# EAGLE design 03_cizgi_sensoru (EAGLE 9.6.2)
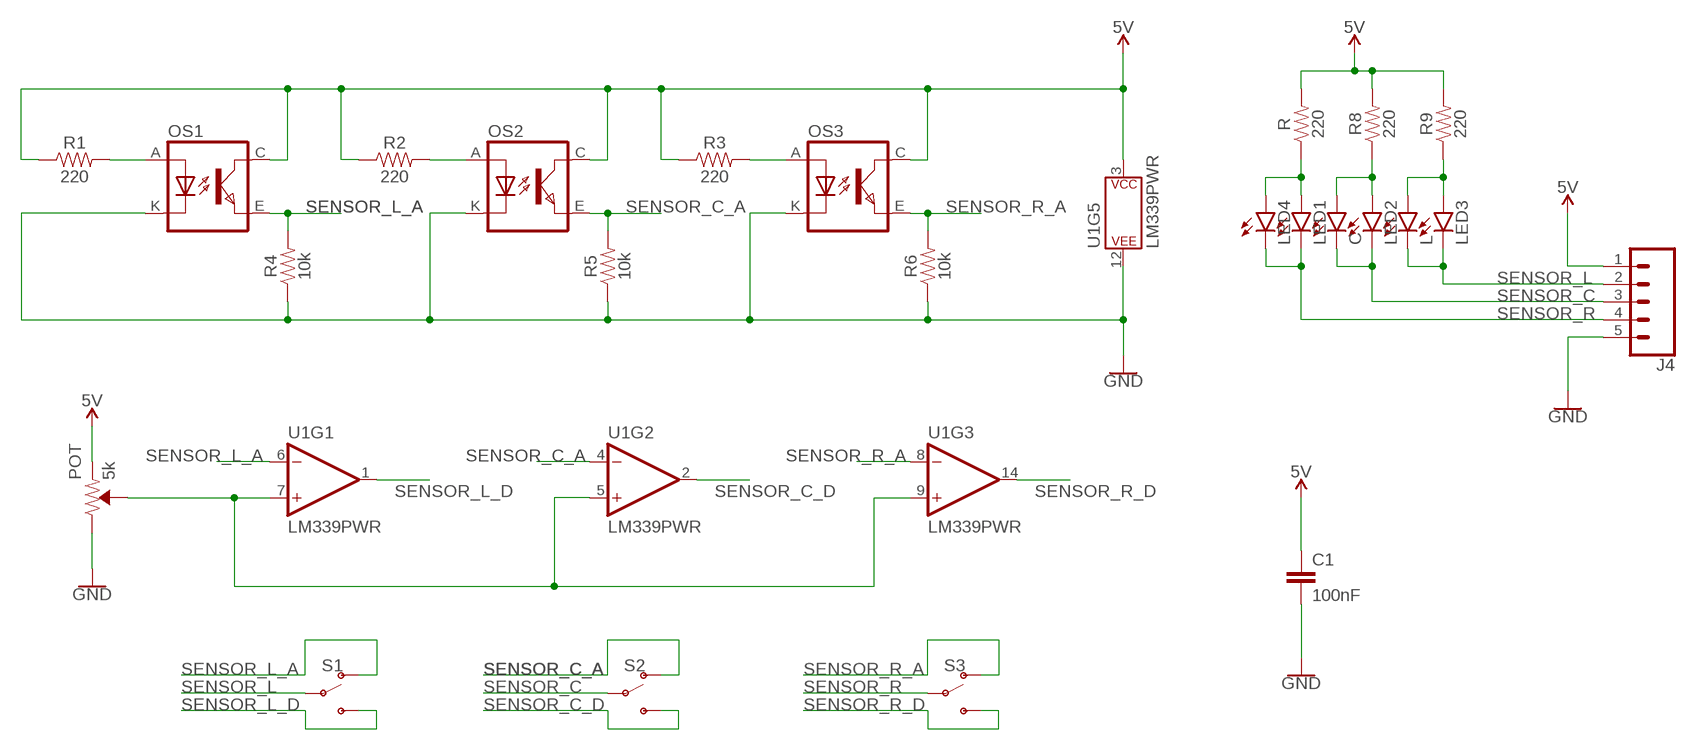
[diagram p0: schematic, sheet 1]

## Parts
C  LEDSML0805  [SML0805]
C1  100nF  0.33UF/330NF-0805-50V-10%  [0805]
J4  CONN_05  [1X05]
L  LEDSML0805  [SML0805]
LED1  LEDSML0805  [SML0805]
LED2  LEDSML0805  [SML0805]
LED3  LEDSML0805  [SML0805]
LED4  LEDSML0805  [SML0805]
OS1  TCRT5000  [TCRT5000]
OS2  TCRT5000  [TCRT5000]
OS3  TCRT5000  [TCRT5000]
POT  5k  TRIMPOT-SMD-5MM-CLOSED-1/4W-20%  [TRIMPOT-SMD-5MM]
R  220  0.22OHM-0805-1/4W-1%  [0805]
R1  220  0.22OHM-0805-1/4W-1%  [0805]
R2  220  0.22OHM-0805-1/4W-1%  [0805]
R3  220  0.22OHM-0805-1/4W-1%  [0805]
R4  10k  0.22OHM-0805-1/4W-1%  [0805]
R5  10k  0.22OHM-0805-1/4W-1%  [0805]
R6  10k  0.22OHM-0805-1/4W-1%  [0805]
R8  220  0.22OHM-0805-1/4W-1%  [0805]
R9  220  0.22OHM-0805-1/4W-1%  [0805]
S1  SWITCH-SPDT-SMD-RIGHT-ANGLE  [SWITCH_SPST_SMD_A]
S2  SWITCH-SPDT-SMD-RIGHT-ANGLE  [SWITCH_SPST_SMD_A]
S3  SWITCH-SPDT-SMD-RIGHT-ANGLE  [SWITCH_SPST_SMD_A]
U1  LM339PWR  LM339  [TSSOP-14]

## Nets
5V: C1.1 J4.1 OS1.C(COLLECTOR) OS2.C(COLLECTOR) OS3.C(COLLECTOR) POT.A(CCW) R1.1 R2.1 R3.1 R8.2 R9.2 R.2 U1.3(P$V+)
GND: C1.2 J4.5 OS1.K(CATHODE) OS2.K(CATHODE) OS3.K(CATHODE) POT.C(CW) R4.1 R5.1 R6.1 U1.12(P$V-)
N$1: OS1.A(ANODE) R1.2
N$2: OS2.A(ANODE) R2.2
N$3: OS3.A(ANODE) R3.2
N$4: POT.B(WIPER) U1.5(+IN) U1.7(+IN) U1.9(+IN)
N$5: LED1.A LED4.A R.1
N$6: C.A LED2.A R8.1
N$7: L.A LED3.A R9.1
SENSOR_C: C.C J4.3 LED2.C S2.2(P)
SENSOR_C_A: OS2.E(EMITTER) R5.2 S2.1(O) U1.4(-IN)
SENSOR_C_D: S2.3(S) U1.2(OUT)
SENSOR_L: J4.2 L.C LED3.C S1.2(P)
SENSOR_L_A: OS1.E(EMITTER) R4.2 S1.1(O) U1.6(-IN)
SENSOR_L_D: S1.3(S) U1.1(OUT)
SENSOR_R: J4.4 LED1.C LED4.C S3.2(P)
SENSOR_R_A: OS3.E(EMITTER) R6.2 S3.1(O) U1.8(-IN)
SENSOR_R_D: S3.3(S) U1.14(OUT)
Unconnected: U1.10(-IN) U1.11(+IN) U1.13(OUT)

## Library data of the parts
C L LED1-LED4 = led:LED: LED OSRAM: - CHIPLED LG R971, LG N971, LY N971, LG Q971, LY Q971, LO R971, LY R971 LH N974, LH R974 LS Q976, LO Q976, LY Q976 LO Q996 - Hyper CHIPLED LW Q18S LB Q993, LB Q99A, LB R99A - SideLED LS A670, LO A670, LY A670, LG A670, LP A670 LB A673, LV A673, LT A673, LW A673 LH A674 LY A675 LS A676, LA A676, LO A676, LY A676, LW A676 LS A679, LY A679, LG A679 - Hyper Micro SIDELED® LS Y876, LA Y876, LO Y876, LY Y876 LT Y87S - SmartLED LW L88C, LW L88S LB L89C, LB L89S, LG L890 LS L89K, LO L89K, LY L89K LS L896, LA L896, LO L896, LY L896 - TOPLED LS T670, LO T670, LY T670, LG T670, LP T670 LSG T670, LSP T670, LSY T670, LOP T670, LYG T670 LG T671, LOG T671, LSG T671 LB T673, LV T673, LT T673, LW T673 LH T674 LS T676, LA T676, LO T676, LY T676, LB T676, LH T676, LSB T676, LW T676 LB T67C, LV T67C, LT T67C, LS T67K, LO T67K, LY T67K, LW E67C LS E67B, LA E67B, LO E67B, LY E67B, LB E67C, LV E67C, LT E67C LW T67C LS T679, LY T679, LG T679 LS T770, LO T770, LY T770, LG T770, LP T770 LB T773, LV T773, LT T773, LW T773 LH T774 LS E675, LA E675, LY E675, LS T675 LS T776, LA T776, LO T776, LY T776, LB T776 LHGB T686 LT T68C, LB T68C - Hyper Mini TOPLED® LB M676 - Mini TOPLED Santana® LG M470 LS M47K, LO M47K, LY M47K Source: http://www.osram.convergy.de LUXEON: - LUMILED® LXK2-PW12-R00, LXK2-PW12-S00, LXK2-PW14-U00, LXK2-PW14-V00 LXK2-PM12-R00, LXK2-PM12-S00, LXK2-PM14-U00 LXK2-PE12-Q00, LXK2-PE12-R00, LXK2-PE12-S00, LXK2-PE14-T00, LXK2-PE14-U00 LXK2-PB12-K00, LXK2-PB12-L00, LXK2-PB12-M00, LXK2-PB14-N00, LXK2-PB14-P00, LXK2-PB14-Q00 LXK2-PR12-L00, LXK2-PR12-M00, LXK2-PR14-Q00, LXK2-PR14-R00 LXK2-PD12-Q00, LXK2-PD12-R00, LXK2-PD12-S00 LXK2-PH12-R00, LXK2-PH12-S00 LXK2-PL12-P00, LXK2-PL12-Q00, LXK2-PL12-R00 Source: www.luxeon.com KINGBRIGHT: KA-3528ASYC Source: www.kingbright.com
C1 = SparkFun-Capacitors:0.33UF/330NF: 0.33µF/330nF ceramic capacitors A capacitor is a passive two-terminal electrical component used to store electrical energy temporarily in an electric field.; PROD_ID: CAP-08469; VALUE: 0.33µF
J4 = SparkFun-Connectors:CONN_05: Multi connection point. Often used as Generic Header-pin footprint for 0.1 inch spaced/style header connections On any of the 0.1 inch spaced packages, you can populate with these: Break Away Headers - Straight <https://www.sparkfun.com/products/116> (PRT-00116) Break Away Male Headers - Right Angle <https://www.sparkfun.com/products/553> (PRT-00553) Female Headers <https://www.sparkfun.com/products/115> (PRT-00115) Break Away Headers - Machine Pin <https://www.sparkfun.com/products/117> (PRT-00117) Break Away Female Headers - Swiss Machine Pin <https://www.sparkfun.com/products/743> (PRT-00743) For SCREWTERMINALS and SPRING TERMINALS visit here: Screw Terimnals on SparkFun.com <https://www.sparkfun.com/search/results?term=Screw+Terminals> (5mm/3.5mm/2.54mm spacing) This device is also useful as a general connection point to wire up your design to another part of your project. Our various solder wires solder well into these plated through hole pads. Hook-Up Wire - Assortment (Stranded, 22 AWG) <https://www.sparkfun.com/products/11375> (PRT-11375) Hook-Up Wire - Assortment (Solid Core, 22 AWG) <https://www.sparkfun.com/products/11367> (PRT-11367) View the entire wire category on our website here <https://www.sparkfun.com/categories/141> Special notes: Molex polarized connector foot print use with SKU : PRT-08231 with associated crimp pins and housings. 1MM SMD Version SKU: PRT-10208
OS1-OS3 = tcrt5000:TCRT5000
POT = SparkFun-Resistors:TRIMPOT: Trimming Potentiometer (Trimpot) Three-terminal potentiometers, with an adjustable wiper and two adjustable resistors. A pot can be used to create a configurable voltage divider, or as a variable resistor. "Trimpots" are a subset of potentiometers, usually intended for "set-and-forget" applications. They're often more delicate than standard potentiometers - rated for fewer turns. Variants PTH-KNOB - PTH Trimpot w/ finger-adjustable knob Trimpot 10K with Knob <https://www.sparkfun.com/products/9806> (COM-09806) Datasheet <http://www.sparkfun.com/datasheets/Components/General/TSR-3386.pdf> SMD-3MM-CLOSED-FRAME - SMD 3mm Square Closed-Frame Trimpot Used on e.g. EasyDriver - Stepper Motor Driver <https://www.sparkfun.com/products/12779> Datasheet <http://www.bitechnologies.com/pdfs/22.pdf> (22AR10KTR) SMD-5MM - SMD 5mm Square Closed-Frame Trimpot Used on e.g. IOIO-OTG - V2.2 <https://www.sparkfun.com/products/13613> Datasheet <http://www.vishay.com/docs/51008/ts53.pdf> (TS53YL502MR10) SMD-3MM-1/10W-25% - 3mm Square Open-Frame Trimpot Used on e.g. SparkFun Shapeoko <https://www.sparkfun.com/products/13899> Datasheet <http://www.bourns.com/docs/Product-Datasheets/TC33.pdf> (TC33X-2-103E); PROD_ID: RES-11156
R R1-R6 R8 R9 = SparkFun-Resistors:0.22OHM: 0.22Ω resistor A resistor is a passive two-terminal electrical component that implements electrical resistance as a circuit element. Resistors act to reduce current flow, and, at the same time, act to lower voltage levels within circuits. - Wikipedia; PROD_ID: RES-09883; VALUE: 0.22
S1-S3 = SparkFun-Switches:SWITCH-SPDT: Single Pole, Double Throw (SPDT) Switch Single-pole, double-throw (SPDT) switch. Variant Overview SMD-AYZ0202 Surface Mount DPDT Switch <https://www.sparkfun.com/products/597> (COM-00597) Used on e.g. LilyPad Arduino USB - ATmega32U4 Board <https://www.sparkfun.com/products/12049> PTH-11.6X4.0MM SPDT Mini Power Switch <https://www.sparkfun.com/products/102> (COM-00102) Used on e.g. SparkFun Simon Says - Through-Hole Soldering Kit <https://www.sparkfun.com/products/10547> (KIT-10547) PTH-11.6X4.0MM-KIT KIT version of SPDT Mini Power Switch - Simplifies soldering by removing tStop of switch pins - only one side can be soldered. PTH-11.6X4.0MM-LOCK LOCK version of SPDT Mini Power Switch - Offset pins hold switch in place for easier soldering. SMD-RIGHT-ANGLE Surface Mount Right Angle Switch <https://www.sparkfun.com/products/10860> (COM-10860) Used on e.g. SparkFun ESP8266 Thing <https://www.sparkfun.com/products/13231>; PROD_ID: SWCH-10651; SF_SKU: COM-10860
U1 = SparkFun-IC-Amplifiers:LM339: Quad Comparator - LM339PWR Based on information from the SLCS006N datasheet from TI (www.ti.com). Created by nick@scantool.net, 2008. Updated 2016. SparkFun Products SparkFun OBD-II UART <https://www.sparkfun.com/products/9555> (WIG-09555) SparkFun Car Diagnostics Kit <https://www.sparkfun.com/products/10769> (RTL-10769); PROD_ID: IC-09990

## Board
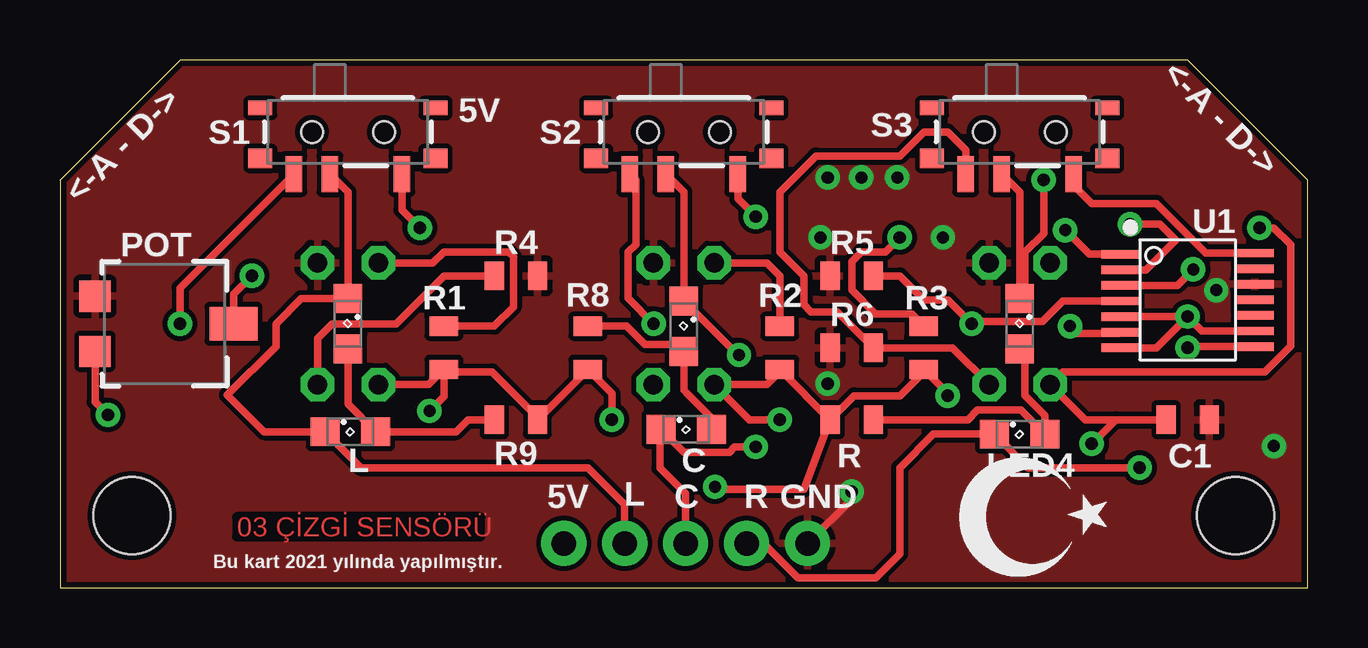
[diagram p1: board, top side]
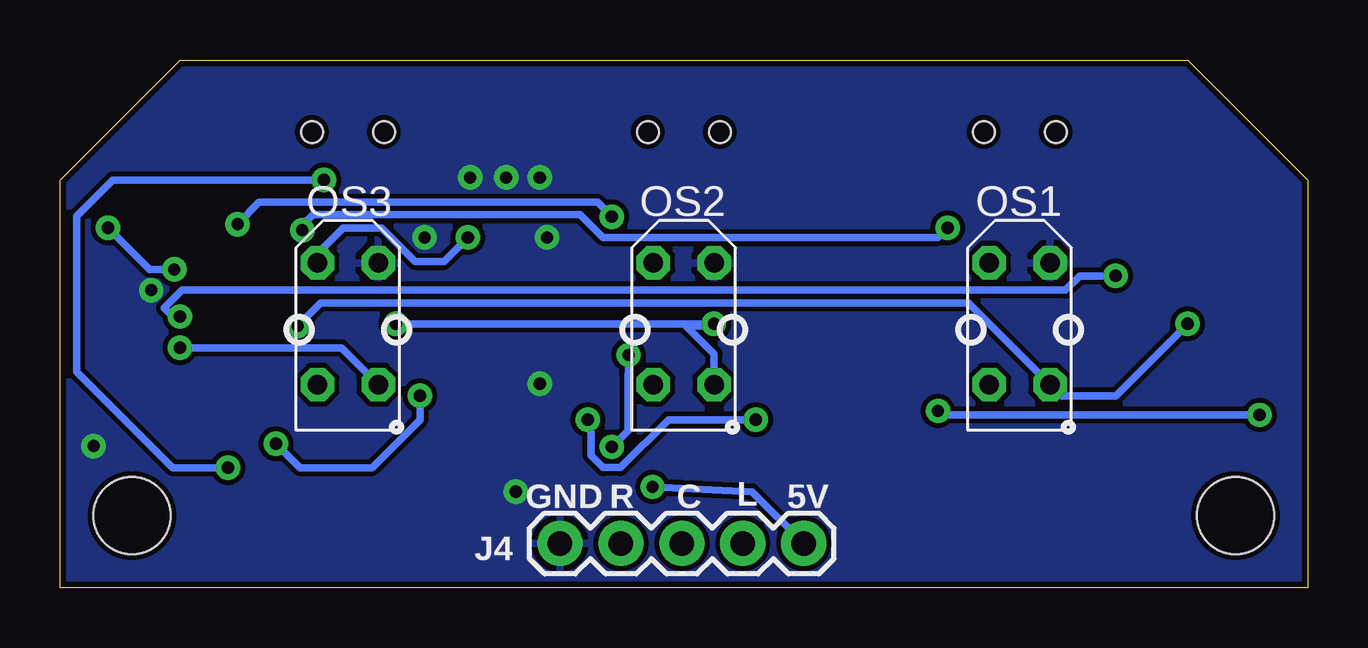
[diagram p2: board, bottom side, seen from below]

Size 52 x 22 mm. Coordinates in mm from the lower left corner, seen from the top.
Outline: 0,0 52,0 52,17 47,22 5,22 0,17 0,0
Copper layers (1*16): Top 0.035mm / dielectric 1.5mm / Bottom 0.035mm
Design rules "SparkFun": minimum track width 8mil, minimum drill 20mil, track to track 8mil, track to pad 8mil, pad to pad 8mil, via to via 8mil, smd to smd 8mil, copper to edge 10mil, drill to drill 8mil, minimum pad ring 12mil, minimum via ring 10mil, stop-mask expansion 4mil, vias tented up to drill 25mil, thermal gap 10mil
Holes 3.2 mm at 3,3 49,3

### Footprints (pad centres in the part's own frame; a part is rotated, then mirrored left to right if it is on the bottom)
SML0805 = smd 1.2 x 1.2: A 1.05,0; C -1.05,0
0805 = smd 0.8 x 1.2: 1 -0.9,0; 2 0.9,0
1X05 = drill 1.016 pad 1.88: 1 0,0; 2 2.54,0; 3 5.08,0; 4 7.62,0; 5 10.16,0
TCRT5000 = drill 0.8 octagon: A -2.54,-1.27; C 2.54,-1.27; E 2.54,1.27; K -2.54,1.27
TRIMPOT-SMD-5MM = smd 1.3 x 1.3: A 1.15,-2.54; C -1.15,-2.54 | smd 1.402 x 2: B 0,3.239
SWITCH_SPST_SMD_A = smd 0.7 x 1.5: 1 -2.25,-1.75; 2 -0.75,-1.75; 3 2.25,-1.75 | smd 1 x 0.6: GND1 -3.65,1; GND3 3.65,1 | smd 1 x 0.8: GND2 -3.65,-1.1; GND4 3.65,-1.1 | hole 0.9: -1.5,0; 1.5,0
TSSOP-14 = smd 1.6 x 0.35: 1 -2.8,1.9; 2 -2.8,1.25; 3 -2.8,0.6; 4 -2.8,-0.05; 5 -2.8,-0.7; 6 -2.8,-1.35; 7 -2.8,-2; 8 2.8,-1.95; 9 2.8,-1.3; 10 2.8,-0.65; 11 2.8,0; 12 2.8,0.65; 13 2.8,1.3; 14 2.8,1.95

### Placement (x,y rotation side)
C  26.1,6.6 0 top
C1  47,7 0 top
J4  21,1.84 180 bottom
L  12.1,6.5 0 top
LED1  40,11 270 top
LED2  26,10.9 270 top
LED3  12,11 270 top
LED4  40,6.4 0 top
OS1  12,11 270 bottom
OS2  26,11 270 bottom
OS3  40,11 270 bottom
POT  4,11 270 top
R  33,7 180 top
R1  16,10 90 top
R2  30,10 90 top
R3  36,10 90 top
R4  19,13 180 top
R5  33,13 0 top
R6  33,10 0 top
R8  22,10 270 top
R9  19,7 0 top
S1  12,19 0 top
S2  26,19 0 top
S3  40,19 0 top
U1  47,12 0 top
U$5  [TR_MINI]  36.3,-0.1 0 top

### Tracks (layer width: path | path; a pad name or v marks a point on that pad's centre or on a via)
5V  (via drill 0.51)
  Top 0.305: R1.1 16.1,9 18,9 19.9,7.1 R9.2 R8.2 23,8.1 v23,7 | OS1.C 15.36,8.46 R1.1 | POT.A 1.46,7.74 v2,7.2 | v15.4,7.36 16,7.96 R1.1 | R.2 31,4.1 27.2,4.1 v27.3,4.2 | R2.1 30.05,9.05 | 30.05,9.05 R.2 | R.2 33.1,8 35,8 36,9 R3.1 37,8.1 v37,8 | 44,7 42.73,7 OS3.C 41.81,9 50.23,9 51.3,10.07 51.3,14.3 50.6,15 v50,15 | 44,7 C1.1 | v47.23,13.26 46.57,12.6 U1.3 | 30.05,9.05 29.46,8.46 OS2.C 28.73,7 v30,7 | v43,6 44,7
  Bottom 0.305: v2,7.2 15.24,7.2 v15.4,7.36 | v50,15 48.26,13.26 v47.23,13.26 | v23,7 26.64,7 28.64,5 29.36,5 29.86,5.51 29.86,6.86 v30,7 | v37,8 37,7 39,5 42,5 v43,6 | J4.1 23.16,4 v27.3,4.2
GND  (via drill 0.51)
  Top 0.305: J4.5 33,3.68 v33,4
  other vias: 32,8.5 34.9,17.1 31.7,14.6 50.6,5.9 48.2,12.4 32,17.1 36.8,14.6 33.4,17.1
  pour Top: -2,24 -2,-3 54,-3 54,24
  pour Bottom: -4,26 -4,-5 56,-5 56,26
N$1
  Top 0.305: OS1.A 15.54,13.54 16,14 18.7,14 18.9,13.8 18.9,11.7 18.1,10.9 R1.2
N$2
  Top 0.305: OS2.A 29.46,13.54 30,13 R2.2
N$3  (via drill 0.51)
  Top 0.305: R3.2 35.5,11.4 34,11.4 33,12.4 33,13.6 33.4,14 34.4,14 v35,14.6
  Bottom 0.305: v35,14.6 36,13.6 37.2,13.6 38.6,15 40.2,15 41.27,13.93 OS3.A
N$4  (via drill 0.51)
  Top 0.305: POT.B 7.24,12.24 v8,13 | U1.5 v47,11.3 | v47,11.3 45.7,10 U1.7 | U1.9 47.6,10.7 v47,11.3
  Bottom 0.305: v8,13 9.5,13 10.1,12.4 46.9,12.4 47.65,11.65 47.3,11.3 v47,11.3
N$5
  Top 0.305: R.1 37.85,7 38.25,7.4 39.9,7.4 | 39.9,7.4 | 39.9,7.4 40.05,7.4 LED4.A 41.05,7.18 40.21,8.02 40.21,9.74 LED1.A
N$6
  Top 0.305: C.A 27.15,7.08 26.11,8.12 26,8.23 LED2.A 25.71,10.14 24.39,10.14 23.62,10.9 R8.1
N$7
  Top 0.305: LED3.A 12,7.65 L.A 16.5,6.5 17,7 R9.1
SENSOR_C  (via drill 0.51)
  Top 0.305: S2.2 26,16.5 LED2.C 28.25,9.7 v28.3,9.7 | v29,5.87 28.12,5.87 27.9,5.64 26.01,5.64 C.C 25,6.55 25,5 26.08,3.92 J4.3
  Bottom 0.305: v29,5.87 28.33,6.54 28.33,8.9 28.3,8.93 v28.3,9.7
SENSOR_C_A  (via drill 0.51)
  Top 0.305: U1.4 41.8,11.95 40.95,11.09 38.09,11.09 v38,11 37,12 36,12 35,13 R5.2 | S2.1 24,17 24,14.31 23.67,13.98 23.67,12.07 v24.74,11
  Bottom 0.305: OS2.E 24.73,9.73 25.9,10.9 24.84,10.9 v24.74,11 v38,11
SENSOR_C_D  (via drill 0.51)
  Top 0.305: U1.2 45.25,13.25 46.5,14.5 45.85,15.15 v44.6,15.15 | v29,15.46 28.25,16.21 S2.3
  Bottom 0.305: v44.6,15.15 43.69,16.06 29.6,16.06 v29,15.46
SENSOR_L
  Top 0.305: S1.2 12,16.5 LED3.C 10.05,12.05 9,11 9,10.05 6.97,8.03 8.5,6.5 L.C 12.55,5 22,5 23.54,3.46 J4.2
SENSOR_L_A  (via drill 0.51)
  Top 0.305: v42.1,10.9 42.4,10.6 44.15,10.6 U1.6 | R4.2 16,13 14,11 11.35,11 10.73,10.38 OS1.E | v5,11 5,12.5 S1.1
  Bottom 0.305: v42.1,10.9 41.14,11.86 14.13,11.86 OS1.E 10.27,8 8,8 v5,11
SENSOR_L_D  (via drill 0.51)
  Top 0.305: U1.1 42.9,13.9 v41.9,14.9 | S1.3 14.25,15.75 v15,15
  Bottom 0.305: v41.9,14.9 41.9,15.11 41.45,15.56 30.31,15.56 29.36,14.6 15.4,14.6 v15,15
SENSOR_R  (via drill 0.51)
  Top 0.305: S3.2 40,16.5 LED1.C 40.21,12.26 40.21,13.98 41,14.77 v41,17 | v45,5 40.35,5 LED4.C 36.4,6.4 35,5 35,1.41 34,0.41 30.76,0.41 29.33,1.84 J4.4
  Bottom 0.305: v41,17 49.8,17 51.3,15.5 51.3,9 47.3,5 v45,5
SENSOR_R_A  (via drill 0.51)
  Top 0.305: v47,10 47.05,10.05 U1.8 | OS3.E 37.19,10 R6.2 32.4,11.5 31.3,11.5 31,11.8 31,13 30,14 30,16.5 31.5,18 35,18 36,19 37,19 37.75,18.25 S3.1
  Bottom 0.305: OS3.E 40.27,10 v47,10
SENSOR_R_D
  Top 0.305: U1.14 47.77,13.95 45.7,16.02 43,16.02 42.25,16.77 S3.3

### Text on the board
Top: 03 ÇİZGİ SENSÖRÜ
tPlace: Bu kart 2021 yılında yapılmıştır.
tNames: <-A - D-> | 5V | <-A - D-> | 5V | L | C | R | GND
bNames: 5V | L | C | R | GND
tStop: 03 ÇİZGİ SENSÖRÜ